# EAGLE schematic P5-Temperatura-DS18B20 (EAGLE 9.6.2)
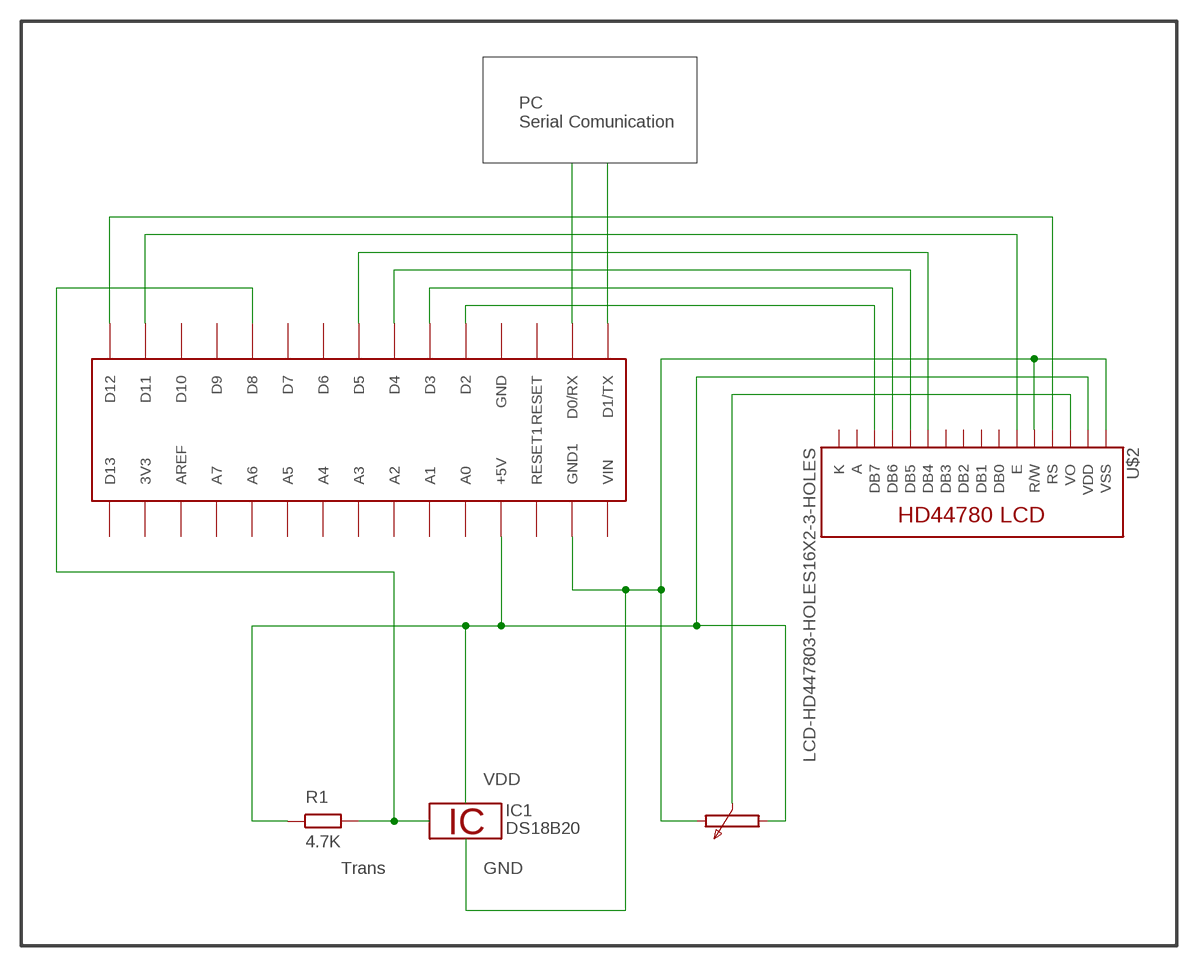
[diagram p0: schematic, sheet 1]

## Parts
IC1  DS18B20  [TO92-]
R1  4.7K  R  (no package)
U$1  ARDUINONANO  [PDIP-32]
U$2  LCD-HD447803-HOLES16X2-3-HOLES  [LCD-16X2-3HOLES]

## Nets
N$1: U$1.D2 U$2.14(DB7)
N$2: U$1.D3 U$2.13(DB6)
N$3: U$1.D4 U$2.12(DB5)
N$4: U$1.D5 U$2.11(DB4)
N$5: U$1.D11 U$2.6(E)
N$6: U$1.D12 U$2.4(RS)
N$7: U$1.GND1 U$2.1(VSS) U$2.5(R/W)
N$8: R1.1 U$1.+5V U$2.2(VDD)
N$9: U$2.3(VO)
N$11: U$1.D0/RX
N$12: R1.2 U$1.D8
N$13: U$1.D1/TX
Unconnected: U$1.3V3 U$1.A0 U$1.A1 U$1.A2 U$1.A3 U$1.A4 U$1.A5 U$1.A6 U$1.A7 U$1.AREF U$1.D6 U$1.D7 U$1.D9 U$1.D10 U$1.D13 U$1.GND U$1.RESET U$1.RESET1 U$1.VIN U$2.7(DB0) U$2.8(DB1) U$2.9(DB2) U$2.10(DB3)

## Notes on the sheet
- PC
  Serial Comunication
- VDD
- Trans | GND

## Power pins joined to a net without a drawn wire
1W: IC1.2
A: U$2.15(A)
GND: IC1.1
K: U$2.16(K)
VDD: IC1.3

## Library data of the parts
IC1 = 1wire:DS18B20: Programmable Resolution Digital Thermometer This chip provides a onewire thermosensor with approx. 0.5°C accuracy. A programmable over/undertemperure alarm is available. The precision can be set from 9..12 bits. Notes: Vdd must be applied for accurate measurements at low temperatures, as the parasite power circuit otherwise heats the sensor. If parasite power is used, Vdd has to be connected to GND. The DS1822 is a low-cost thermometer chip, the DS18S20 is similar to the DS18B20, but with 9 Bit precision only. Author: Jan Kandziora <jjj@gmx.de>
R1 = ngspice-simulation:R: RESISTOR
U$1 = jet-lib:ARDUINONANO
U$2 = HD44780LCD:LCD-HD44780